# EAGLE schematic Rechargeable battery capacity tester (EAGLE 6.3)
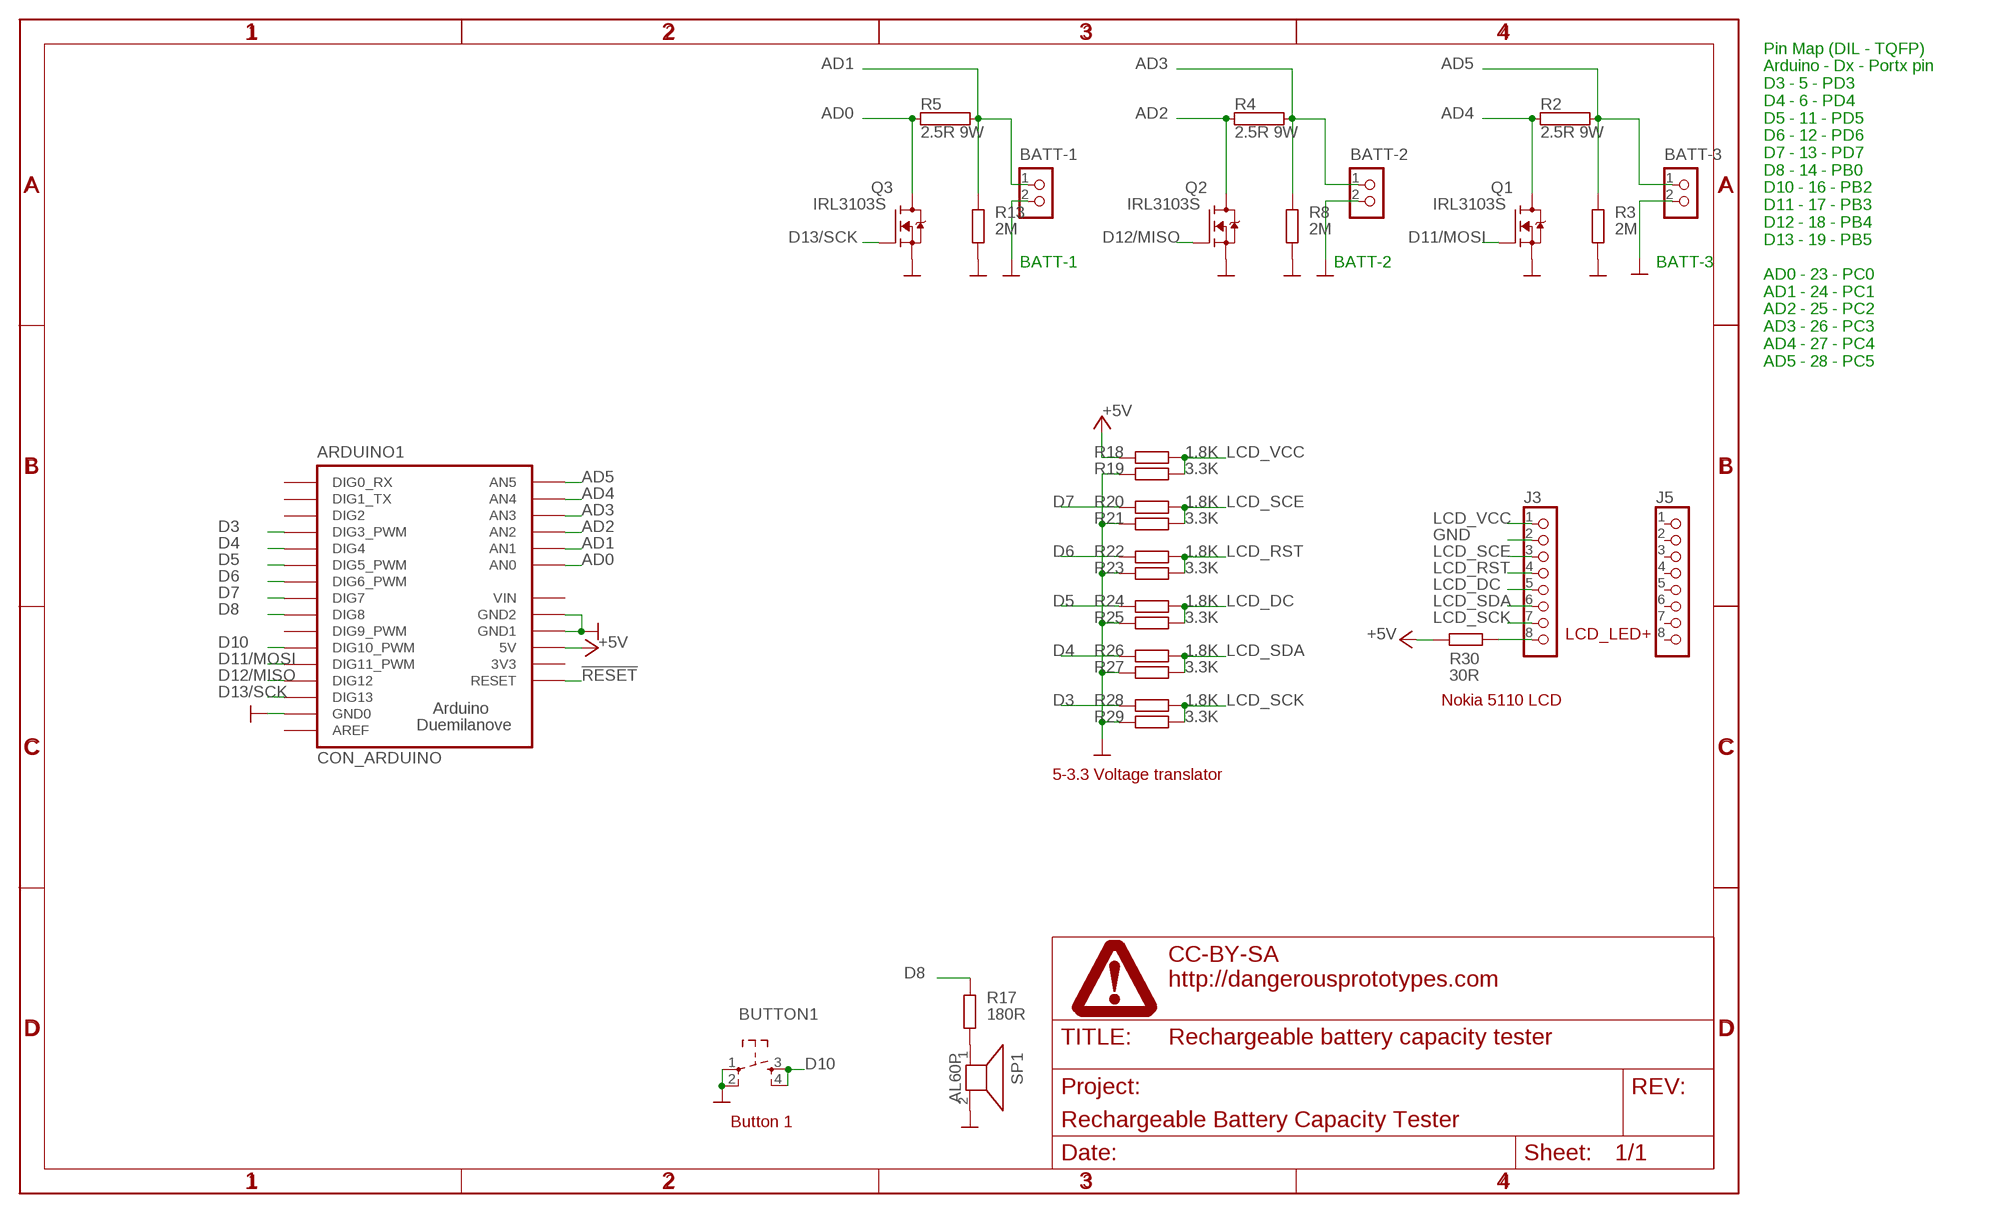
[diagram p0: schematic, sheet 1]

## Parts
ARDUINO1  CON_ARDUINO  [CON_ARDUINO]
BATT-1  CON_TERMINAL_BLOCK_02-5MM  [TERMINAL_BLOCK_2P_5]
BATT-2  CON_TERMINAL_BLOCK_02-5MM  [TERMINAL_BLOCK_2P_5]
BATT-3  CON_TERMINAL_BLOCK_02-5MM  [TERMINAL_BLOCK_2P_5]
BUTTON1  SW_TACT_4P  [SW_TACT_SMALL]
J3  CON_HEADER_1X08-PTH  [M1X8]
J5  CON_HEADER_1X08-PTH  [M1X8]
Q1  IRL3103S  TRANSISTOR_MOSFET-N-D2PAK  [D2PAK]
Q2  IRL3103S  TRANSISTOR_MOSFET-N-D2PAK  [D2PAK]
Q3  IRL3103S  TRANSISTOR_MOSFET-N-D2PAK  [D2PAK]
R2  2.5R 9W  RKH208-8  [KH208-8]
R3  2M  RESISTOR-0603  [R603]
R4  2.5R 9W  RKH208-8  [KH208-8]
R5  2.5R 9W  RKH208-8  [KH208-8]
R8  2M  RESISTOR-0603  [R603]
R13  2M  RESISTOR-0603  [R603]
R17  180R  RESISTOR-0603  [R603]
R18  1.8K  RESISTOR-0603  [R603]
R19  3.3K  RESISTOR-0603  [R603]
R20  1.8K  RESISTOR-0603  [R603]
R21  3.3K  RESISTOR-0603  [R603]
R22  1.8K  RESISTOR-0603  [R603]
R23  3.3K  RESISTOR-0603  [R603]
R24  1.8K  RESISTOR-0603  [R603]
R25  3.3K  RESISTOR-0603  [R603]
R26  1.8K  RESISTOR-0603  [R603]
R27  3.3K  RESISTOR-0603  [R603]
R28  1.8K  RESISTOR-0603  [R603]
R29  3.3K  RESISTOR-0603  [R603]
R30  30R  RESISTOR-0603  [R603]
SP1  AL60P  [AL60P]
U$1  FRAME_DINA4_L  [DP_LOGO]

## Nets
!RESET: ARDUINO1.RESET
+5V: ARDUINO1.5V R18.1 R30.1 ; supply symbol labelled SUPPLY_+5V
AD0: ARDUINO1.A_0(AN0) Q3.2(D) R5.1
AD1: ARDUINO1.A_1(AN1) BATT-1.1 R5.2 R13.2
AD2: ARDUINO1.A_2(AN2) Q2.2(D) R4.1
AD3: ARDUINO1.A_3(AN3) BATT-2.1 R4.2 R8.2
AD4: ARDUINO1.A_4(AN4) Q1.2(D) R2.1
AD5: ARDUINO1.A_5(AN5) BATT-3.1 R2.2 R3.2
D3: ARDUINO1.D_3(DIG3_PWM) R28.1
D4: ARDUINO1.D_4(DIG4) R26.1
D5: ARDUINO1.D_5(DIG5_PWM) R24.1
D6: ARDUINO1.D_6(DIG6_PWM) R22.1
D7: ARDUINO1.D_7(DIG7) R20.1
D8: ARDUINO1.D_8(DIG8) R17.2
D10: ARDUINO1.D_10(DIG10_PWM) BUTTON1.3 BUTTON1.4
D11/MOSI: ARDUINO1.D_11(DIG11_PWM) Q1.1(G)
D12/MISO: ARDUINO1.D_12(DIG12) Q2.1(G)
D13/SCK: ARDUINO1.D_13(DIG13) Q3.1(G)
GND: ARDUINO1.GND0 ARDUINO1.GND1 ARDUINO1.GND2 BATT-1.2 BATT-2.2 BATT-3.2 BUTTON1.1 BUTTON1.2 J3.2 Q1.3(S) Q2.3(S) Q3.3(S) R3.1 R8.1 R13.1 R19.1 R21.1 R23.1 R25.1 R27.1 R29.1 SP1.2 ; supply symbol labelled SUPPLY_GND
LCD_DC: J3.5 R24.2 R25.2
LCD_RST: J3.4 R22.2 R23.2
LCD_SCE: J3.3 R20.2 R21.2
LCD_SCK: J3.7 R28.2 R29.2
LCD_SDA: J3.6 R26.2 R27.2
LCD_VCC: J3.1 R18.2 R19.2
N$4: J3.8 R30.2
N$7: R17.1 SP1.1
Unconnected: ARDUINO1.3V3 ARDUINO1.AREF ARDUINO1.D_0(DIG0_RX) ARDUINO1.D_1(DIG1_TX) ARDUINO1.D_2(DIG2) ARDUINO1.D_9(DIG9_PWM) J5.1 J5.2 J5.3 J5.4 J5.5 J5.6 J5.7 J5.8

## Notes on the sheet
- BATT-1 | BATT-2 | BATT-3
- Pin Map (DIL - TQFP)
  Arduino - Dx - Portx pin
  D3 - 5 - PD3
  D4 - 6 - PD4
  D5 - 11 - PD5
  D6 - 12 - PD6
  D7 - 13 - PD7
  D8 - 14 - PB0
  D10 - 16 - PB2
  D11 - 17 - PB3
  D12 - 18 - PB4
  D13 - 19 - PB5
  
  AD0 - 23 - PC0
  AD1 - 24 - PC1
  AD2 - 25 - PC2
  AD3 - 26 - PC3
  AD4 - 27 - PC4
  AD5 - 28 - PC5
- LCD_LED+
- Nokia 5110 LCD
- 5-3.3 Voltage translator
- Button 1

## Power pins joined to a net without a drawn wire
VIN: ARDUINO1.VIN

## Library data of the parts
ARDUINO1 = dp_devices:CON_ARDUINO: Arduino board connector layout
BATT-1-BATT-3 = dp_devices:CON_TERMINAL_BLOCK_02: 2 poles wire to board terminal block
BUTTON1 = dp_devices:SW_TACT_4P
J3 J5 = dp_devices:CON_HEADER_1X08
Q1-Q3 = dp_devices.v6:TRANSISTOR_MOSFET-N
R2 R4 R5 = resistor-power:R: Power Resitor; OC_FARNELL: unknown; OC_NEWARK: unknown
R3 R8 R13 R17-R30 = dp_devices:RESISTOR
SP1 = buzzer:AL60P: SPEAKER Source: Buerklin; OC_FARNELL: unknown; OC_NEWARK: unknown
U$1 = dp_devices:FRAME_DINA4_L: A4 DP frame Standard Dangerous Prototypes schematic frame. Automagically adds the DP logo and standard texts to the PCB Use the atrribute in the schematic editor to change the fields.; FF1: Credits to: http://www.instructables.com/member/BrianH/; LICENSE: CC-BY-SA; PROJECT: Rechargeable Battery Capacity Tester; URL1: http://dangerousprototypes.com; URL2: http://www.instructables.com/id/Rechargeable-Battery-Capacity-Tester/